# Altium schematic sheet 12.SchDoc
size 297 x 209 mm
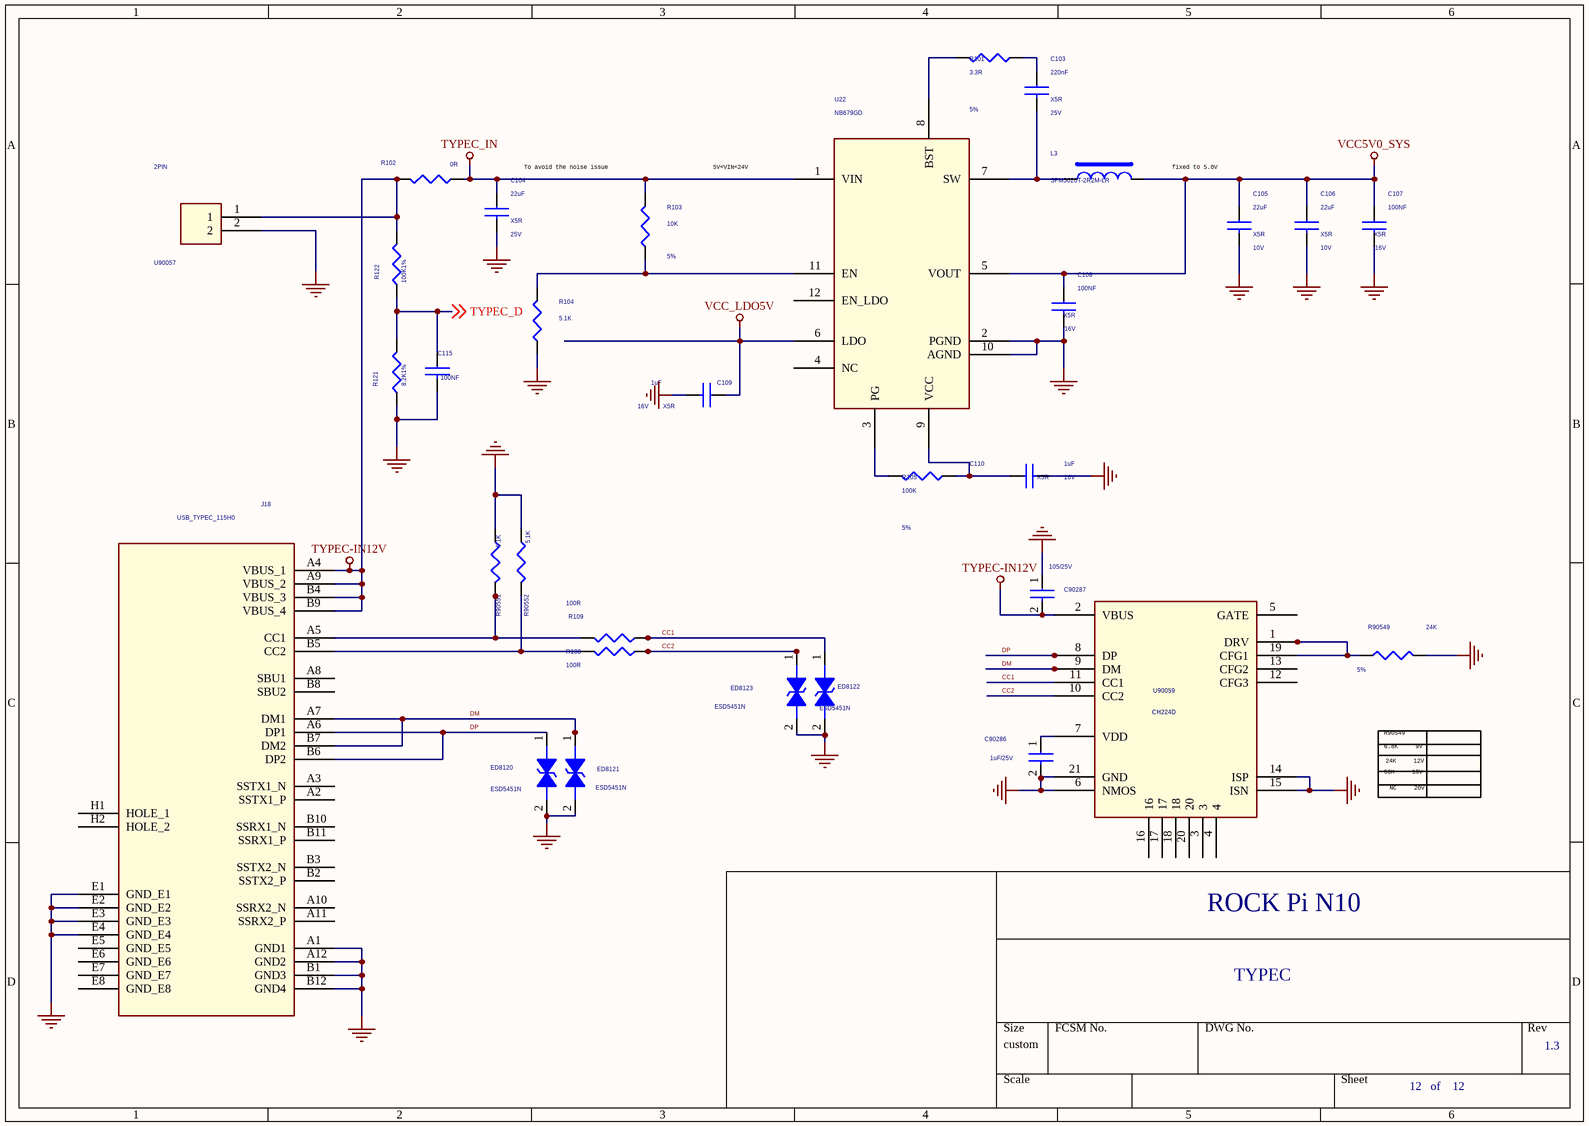
[diagram p0: 12.SchDoc]

## Parts
C103  220nF  Dielectric: X5R  Voltage: 25V  [C0402]
C104  22uF  Dielectric: X5R  Voltage: 25V  [C0805]
C105  22uF  Dielectric: X5R  Voltage: 10V  [C0603]
C106  22uF  Dielectric: X5R  Voltage: 10V  [C0603]
C107  100NF  Dielectric: X5R  Voltage: 16V  [C0402]
C108  100NF  Dielectric: X5R  Voltage: 16V  [C0402]
C109  1uF  Dielectric: X5R  Voltage: 16V  [C0402]
C110  1uF  Dielectric: X5R  Voltage: 16V  [C0402]
C115  100NF  [C0402]
C90286  1uF/25V  [C0603]
C90287  105/25V  [C0402]
ED8120  ESD5451N  [E0402N]
ED8121  ESD5451N  [E0402N]
ED8122  ESD5451N  [E0402N]
ED8123  ESD5451N  [E0402N]
J18  USB_TYPEC_115H0  [TYPEC-16PIN-GY]
L3  SPM5020T-2R2M-LR  [IND-5020]
R101  3.3R  Tolerance: 5%  [R0402]
R102  0R  [R1206]
R103  10K  Tolerance: 5%  [R0402]
R104  5.1K  [R0402]
R105  100K  Tolerance: 5%  [R0402]
R108  100R  [R0402]
R109  100R  [R0402]
R121  8.2K1%  [R0402]
R122  100K1%  [R0402]
R90549  24K  Tolerance: 5%  [R0402]
R90551  5.1K  [R0402]
R90552  5.1K  [R0402]
U22  NB679GD  [QFN12_3R00X2R00X0R90]
U90057  2PIN  [2PIN_2_54]
U90059  CH224D  [CH224D]

## Nets
GND: C104.2 C105.2 C106.2 C107.2 C108.2 C109.2 C110.2 C115.2 C90286.2 C90287.1 ED8120.2 ED8121.2 ED8122.2 ED8123.2 J18.A1(GND1) J18.A12(GND2) J18.B1(GND3) J18.B12(GND4) J18.E1(GND_E1) J18.E2(GND_E2) J18.E3(GND_E3) J18.E4(GND_E4) R104.1 R121.1 R90549.1 R90551.1 R90552.1 U22.2(PGND) U22.10(AGND) U90057.2 U90059.6(NMOS) U90059.14(ISP) U90059.15(ISN) U90059.21(GND)
TYPEC-IN12V: C90287.2 J18.A4(VBUS_1) J18.A9(VBUS_2) J18.B4(VBUS_3) J18.B9(VBUS_4) R102.2 R122.2 U90057.1 U90059.2(VBUS)
TYPEC_IN: C104.1 R102.1 R103.2 U22.1(VIN)
VCC5V0_SYS: C105.1 C106.1 C107.1 C108.1 L3.2 U22.5(VOUT)
VCC_LDO5V: C109.1 U22.6(LDO)
CC1: ED8122.1 R109.2 U90059.11(CC1)
CC2: ED8123.1 R108.2 U90059.10(CC2)
DM: ED8121.1 J18.A7(DM1) J18.B7(DM2) U90059.9(DM)
DP: ED8120.1 J18.A6(DP1) J18.B6(DP2) U90059.8(DP)
TYPEC_D: C115.1 R121.2 R122.1 ; off-sheet TYPEC_D
NetC103_1: C103.1 R101.2
NetC103_2: C103.2 L3.1 U22.7(SW)
NetC110_1: C110.1 R105.2 U22.9(VCC)
NetC90286_1: C90286.1 U90059.7(VDD)
NetJ18_A5: J18.A5(CC1) R109.1 R90551.2
NetJ18_B5: J18.B5(CC2) R108.1 R90552.2
NetR101_1: R101.1 U22.8(BST)
NetR103_1: R103.1 R104.2 U22.11(EN)
NetR105_1: R105.1 U22.3(PG)
NetR90549_2: R90549.2 U90059.1(DRV) U90059.19(CFG1)

Not connected (* = marked no-connect by the designer): J18 A2(SSTX1_P) A3(SSTX1_N) A8(SBU1) A10(SSRX2_N) A11(SSRX2_P) B2(SSTX2_P) B3(SSTX2_N) B8(SBU2) B10(SSRX1_N) B11(SSRX1_P) E5(GND_E5) E6(GND_E6) E7(GND_E7) E8(GND_E8) H1(HOLE_1) H2(HOLE_2); U22 4(NC) 12(EN_LDO); U90059 3 4 5(GATE) 12(CFG3) 13(CFG2) 16 17 18 20

## Notes on the sheet
- To avoid the noise issue
- 5V<VIN<24V
- fixed to 5.0V
- R90549
- 6.8K     9V
- 56K     15V
- 24K     12V
- NC     20V
- ROCK Pi N10
- TYPEC
- 1.3
- 12   of    12

## Library data of the parts
C103 = CAP NP_2: cap,220.00nF,+/-10%,25V,X5R,C0402; Manufacturer PN: C1005X5R1E224K050BC; Manufacturer: TDK; Tolerance: 10%; Priority: A; Created by: JJJ; Part Type: C0402; RK PN: C1005X5R1E224K050BC
C104 = CAP NP_2: cap,10.00uF,+/-10%,16V,X5R,C0805; Manufacturer: TDK; RK PN: C2012X5R1C106K125AC; Priority: A; Tolerance: 10%; Part Type: C0805; Manufacturer PN: C2012X5R1C106K125AC; Created by: JJJ
C105 C106 = CAP NP_2: cap,22.00uF,+/-10%,10V,X5R,C0805; Manufacturer: TDK; RK PN: C2012X5R1A226K125AB; Priority: A; Tolerance: 10%; Part Type: C0805; Manufacturer PN: C2012X5R1A226K125AB; Created by: JJJ
C107 C115 = CAP NP_2: cap,100.00nF,+/-10%,16V,X5R,C0402; Manufacturer PN: C1005X5R1C104K050BA; Manufacturer: TDK; Tolerance: 10%; Priority: A; Created by: JJJ; Part Type: C0402; RK PN: C1005X5R1C104K050BA
  C115: Dielectric: X5R; Voltage: 16V
C108 = CAP NP_2: cap,100.00nF,+/-10%,16V,X5R,C0402; Manufacturer: TDK; RK PN: C1005X5R1C104K050BA; Priority: A; Tolerance: 10%; Part Type: C0402; Manufacturer PN: C1005X5R1C104K050BA; Created by: JJJ
C109 = CAP NP_2: cap,1.00uF,+/-10%,16V,X5R,C0402; Manufacturer PN: C1005X5R1C105K050BC; Manufacturer: TDK; Tolerance: 10%; Priority: A; Created by: JJJ; Part Type: C0402; RK PN: C1005X5R1C105K050BC
C110 = CAP NP_2: cap,1.00uF,+/-10%,16V,X5R,C0402; Manufacturer: TDK; RK PN: C1005X5R1C105K050BC; Priority: A; Tolerance: 10%; Part Type: C0402; Manufacturer PN: C1005X5R1C105K050BC; Created by: JJJ
C90286 = CAP NP: cap,1.00uF,+/-10%,16V,X5R,C0402; Manufacturer PN: C1005X5R1C105K050BC; Manufacturer: TDK; Tolerance: 10%; Priority: A; Voltage: 16V; Dielectric: X5R; Created by: JJJ; Part Type: C0402; RK PN: C1005X5R1C105K050BC
C90287 = CAP NP: cap,1.00uF,+/-10%,16V,X5R,C0402; Manufacturer: TDK; Voltage: 25V; RK PN: C1005X5R1C105K050BC; Priority: A; Tolerance: 10%; Dielectric: X5R; Part Type: C0402; Manufacturer PN: C1005X5R1C105K050BC; Created by: JJJ
ED8120-ED8123 = DIODE BI_DIR TRIG: 1-Line, Bi-directional, Transient Voltage Suppressors.17.5pF.; Manufacturer: WillSemi(韦尔半导体); Priority: A; RK PN: ESD5451N; Part Type: ESD_TVS; Manufacturer PN: ESD5451N; Created by: JJJ
J18 = USB31_TYPE_C: USB Type-C 连接座; Manufacturer: 泰科; Priority: A; RK PN: USB_TYPEC_115H0; Part Type: USB Jack; Manufacturer Part Number: USB_TYPEC_115H0; Created by: JJJ
L3 = INDUCTORS OF FERRITE
R101 = RESISTOR_3: 通用厚膜电阻,3R3,+/-5%,R0402,1/16W.; Manufacturer PN: RC0402JR-073R3L; Manufacturer: YAGEO; Wattage: 1/16W; Priority: A; Created by: YTL; Part Type: 通用厚膜电阻; RK PN: RC0402JR-073R3L
R102 = R_0: SMD  1206  0R  1/4W  ±1%  ROHS
R103 = RESISTOR_3: 通用厚膜电阻,10K,+/-5%,R0402,1/16W.; Manufacturer: YAGEO; RK PN: RC0402JR-0710KL; Priority: A; Wattage: 1/16W; Part Type: 通用厚膜电阻; Manufacturer PN: RC0402JR-0710KL; Created by: YTL
R104 = RESISTOR_3: 通用厚膜电阻,10K,+/-5%,R0402,1/16W.; Manufacturer PN: RC0402JR-0710KL; Manufacturer: YAGEO; Tolerance: 5%; Wattage: 1/16W; Priority: A; Created by: YTL; Part Type: 通用厚膜电阻; RK PN: RC0402JR-0710KL
R105 = RESISTOR_3: 通用厚膜电阻,100K,+/-5%,R0402,1/16W.; Manufacturer: YAGEO; RK PN: RC0402JR-07100KL; Priority: A; Wattage: 1/16W; Part Type: 通用厚膜电阻; Manufacturer PN: RC0402JR-07100KL; Created by: YTL
R108 R109 = RESISTOR_3: 通用厚膜电阻,100K,+/-5%,R0402,1/16W.; Manufacturer: YAGEO; Tolerance: 5%; RK PN: RC0402JR-07100KL; Priority: A; Wattage: 1/16W; Part Type: 通用厚膜电阻; Manufacturer PN: RC0402JR-07100KL; Created by: YTL
R121 = RESISTOR_3: 通用厚膜电阻,8.2K,+/-1%,R0402,1/16W.; Manufacturer: YAGEO; Tolerance: 5%; RK PN: RC0402JR-0710KL; Priority: A; Wattage: 1/16W; Part Type: 通用厚膜电阻; Manufacturer PN: RC0402JR-0710KL; Created by: YTL
R122 = RESISTOR_3: 通用厚膜电阻,100K,+/-1%,R0402,1/16W.; Manufacturer PN: RC0402JR-0710KL; Manufacturer: YAGEO; Tolerance: 5%; Wattage: 1/16W; Priority: A; Created by: YTL; Part Type: 通用厚膜电阻; RK PN: RC0402JR-0710KL
R90549 = RESISTOR_2: 通用厚膜电阻,10K,+/-5%,R0402,1/16W.; Manufacturer PN: RC0402JR-0710KL; Manufacturer: YAGEO; Wattage: 1/16W; Priority: A; Created by: YTL; Part Type: 通用厚膜电阻; RK PN: RC0402JR-0710KL
R90551 = RESISTOR_2: 通用厚膜电阻,10K,+/-5%,R0402,1/16W.; Manufacturer PN: RC0402JR-0710KL; Manufacturer: YAGEO; Tolerance: 5%; Wattage: 1/16W; Priority: A; Created by: YTL; Part Type: 通用厚膜电阻; RK PN: RC0402JR-0710KL
R90552 = RESISTOR_2: 通用厚膜电阻,10K,+/-5%,R0402,1/16W.; Manufacturer: YAGEO; Tolerance: 5%; RK PN: RC0402JR-0710KL; Priority: A; Wattage: 1/16W; Part Type: 通用厚膜电阻; Manufacturer PN: RC0402JR-0710KL; Created by: YTL
U22 = DCDC_NB679: 26 V, Low Iq, High Current, Fixed 5 V-8 A Synchronous Buck Converter with 100 mA LDO;; Manufacturer: MPS （美国芯源）; RK PN: NB679GD; Priority: A; Part Type: DCDC; Manufacturer PN: NB679GD; Created by: JJJ